# EAGLE schematic tvac_systems_interface (EAGLE 9.5.0)
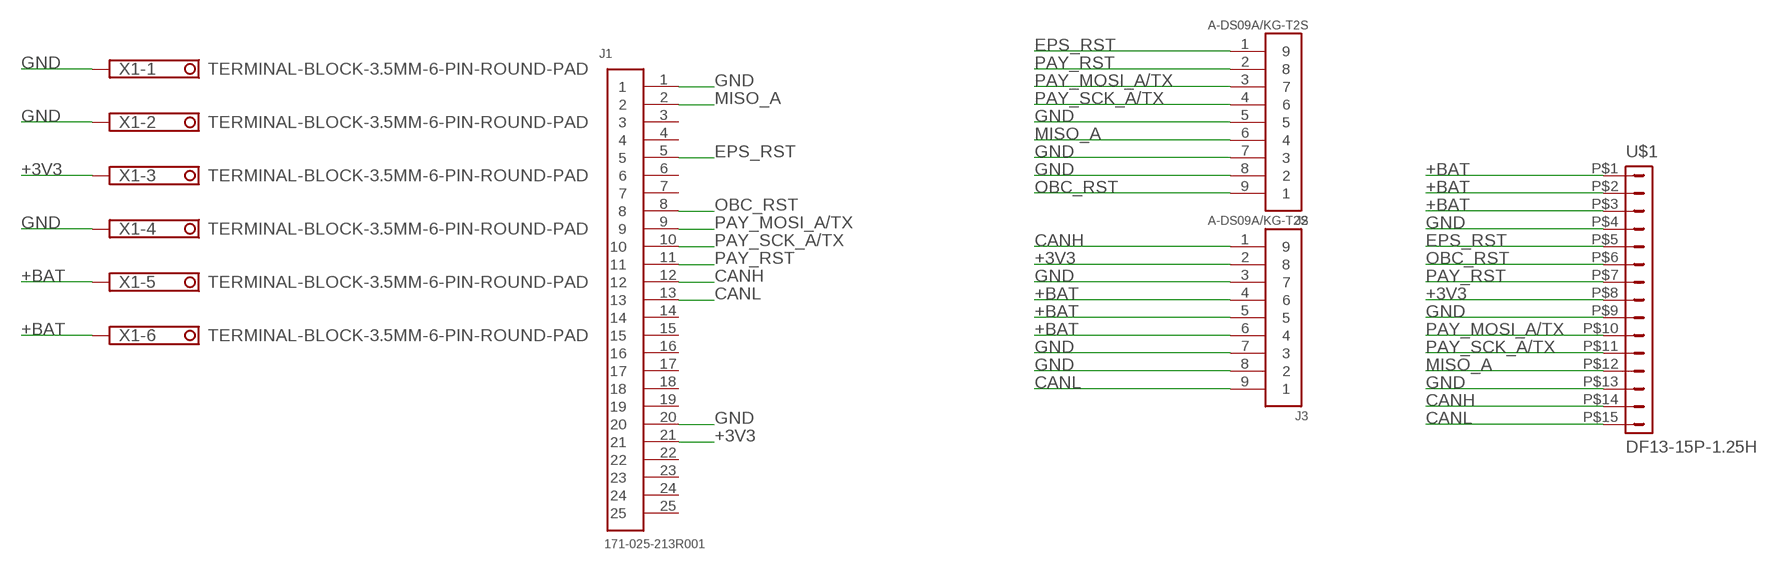
[diagram p0: schematic, sheet 1]

## Parts
J1  171-025-213R001  [171-025-213R001]
J2  A-DS09A/KG-T2S  [A-DS09A/KG-T2S]
J3  A-DS09A/KG-T2S  [A-DS09A/KG-T2S]
U$1  DF13-15P-1.25H  [DF13A-15P-1.25H]
X1  TERMINAL-BLOCK-3.5MM-6-PIN-ROUND-PAD  [TERMINAL-BLOCK-6-PIN-3.5MM-ROUND-PAD]

## Nets
+3V3 [power]: J1.21 J3.2 U$1.P$8 X1.3
+BAT [BAT]: J3.4 J3.5 J3.6 U$1.P$1 U$1.P$2 U$1.P$3 X1.5 X1.6
CANH: J1.12 J3.1 U$1.P$14
CANL: J1.13 J3.9 U$1.P$15
EPS_RST: J1.5 J2.1 U$1.P$5
GND [power]: J1.1 J1.20 J2.5 J2.7 J2.8 J3.3 J3.7 J3.8 U$1.P$4 U$1.P$9 U$1.P$13 X1.1 X1.2 X1.4
MISO_A: J1.2 J2.6 U$1.P$12
OBC_RST: J1.8 J2.9 U$1.P$6
PAY_MOSI_A/TX: J1.9 J2.3 U$1.P$10
PAY_RST: J1.11 J2.2 U$1.P$7
PAY_SCK_A/TX: J1.10 J2.4 U$1.P$11
Unconnected: J1.3 J1.4 J1.6 J1.7 J1.14 J1.15 J1.16 J1.17 J1.18 J1.19 J1.22 J1.23 J1.24 J1.25

## Library data of the parts
J1 = D-Sub Connectors:171-025-213R001: CONN D-SUB RCPT 25P PNL MNT SLDR Manufacturer's datasheet <https://www.norcomp.net/rohspdfs/Connectors/17Y/171/171-YYY-213RYY1.pdf>; CREATED_BY: PCBLayout.com; DIGIKEY_PART_NO: 4225FE-ND; MANUFACTURER: NorComp Inc.; MPN: 171-025-213R001
J2 J3 = D-Sub Connectors:A-DS09A/KG-T2S: CONN D-SUB PLUG 9POS R/A SOLDER Manufacturer's datasheet <http://www.assmann-wsw.com/fileadmin/datasheets/ASS_4888_CO.pdf>; CREATEDBY: PCBLayout.com; DIGI_KEY_PART_NUMBER: AE10968-ND; MANUFACTURER: Assmann WSW Components; MPN: A-DS 09 A/KG-T2S
U$1 = con-hirose-df13:DF13-15P-1.25: DF13-15P 1.25mm Pitch Miniature Crimping Connector.
X1 = Rembrandt Electronics - Terminal Block 3-5mm v1-0:TERMINAL-BLOCK-3.5MM-6-PIN: Terminal Block 3.5mm Pitch: 3,5 mm Number of pins: 6 Created by Rembrandt Electronics www.rembrandtelectronics.com

## Net classes
1 power: width 0.762 mm